# Altium schematic sheet [06] - FPGA Aux.SchDoc
size A3
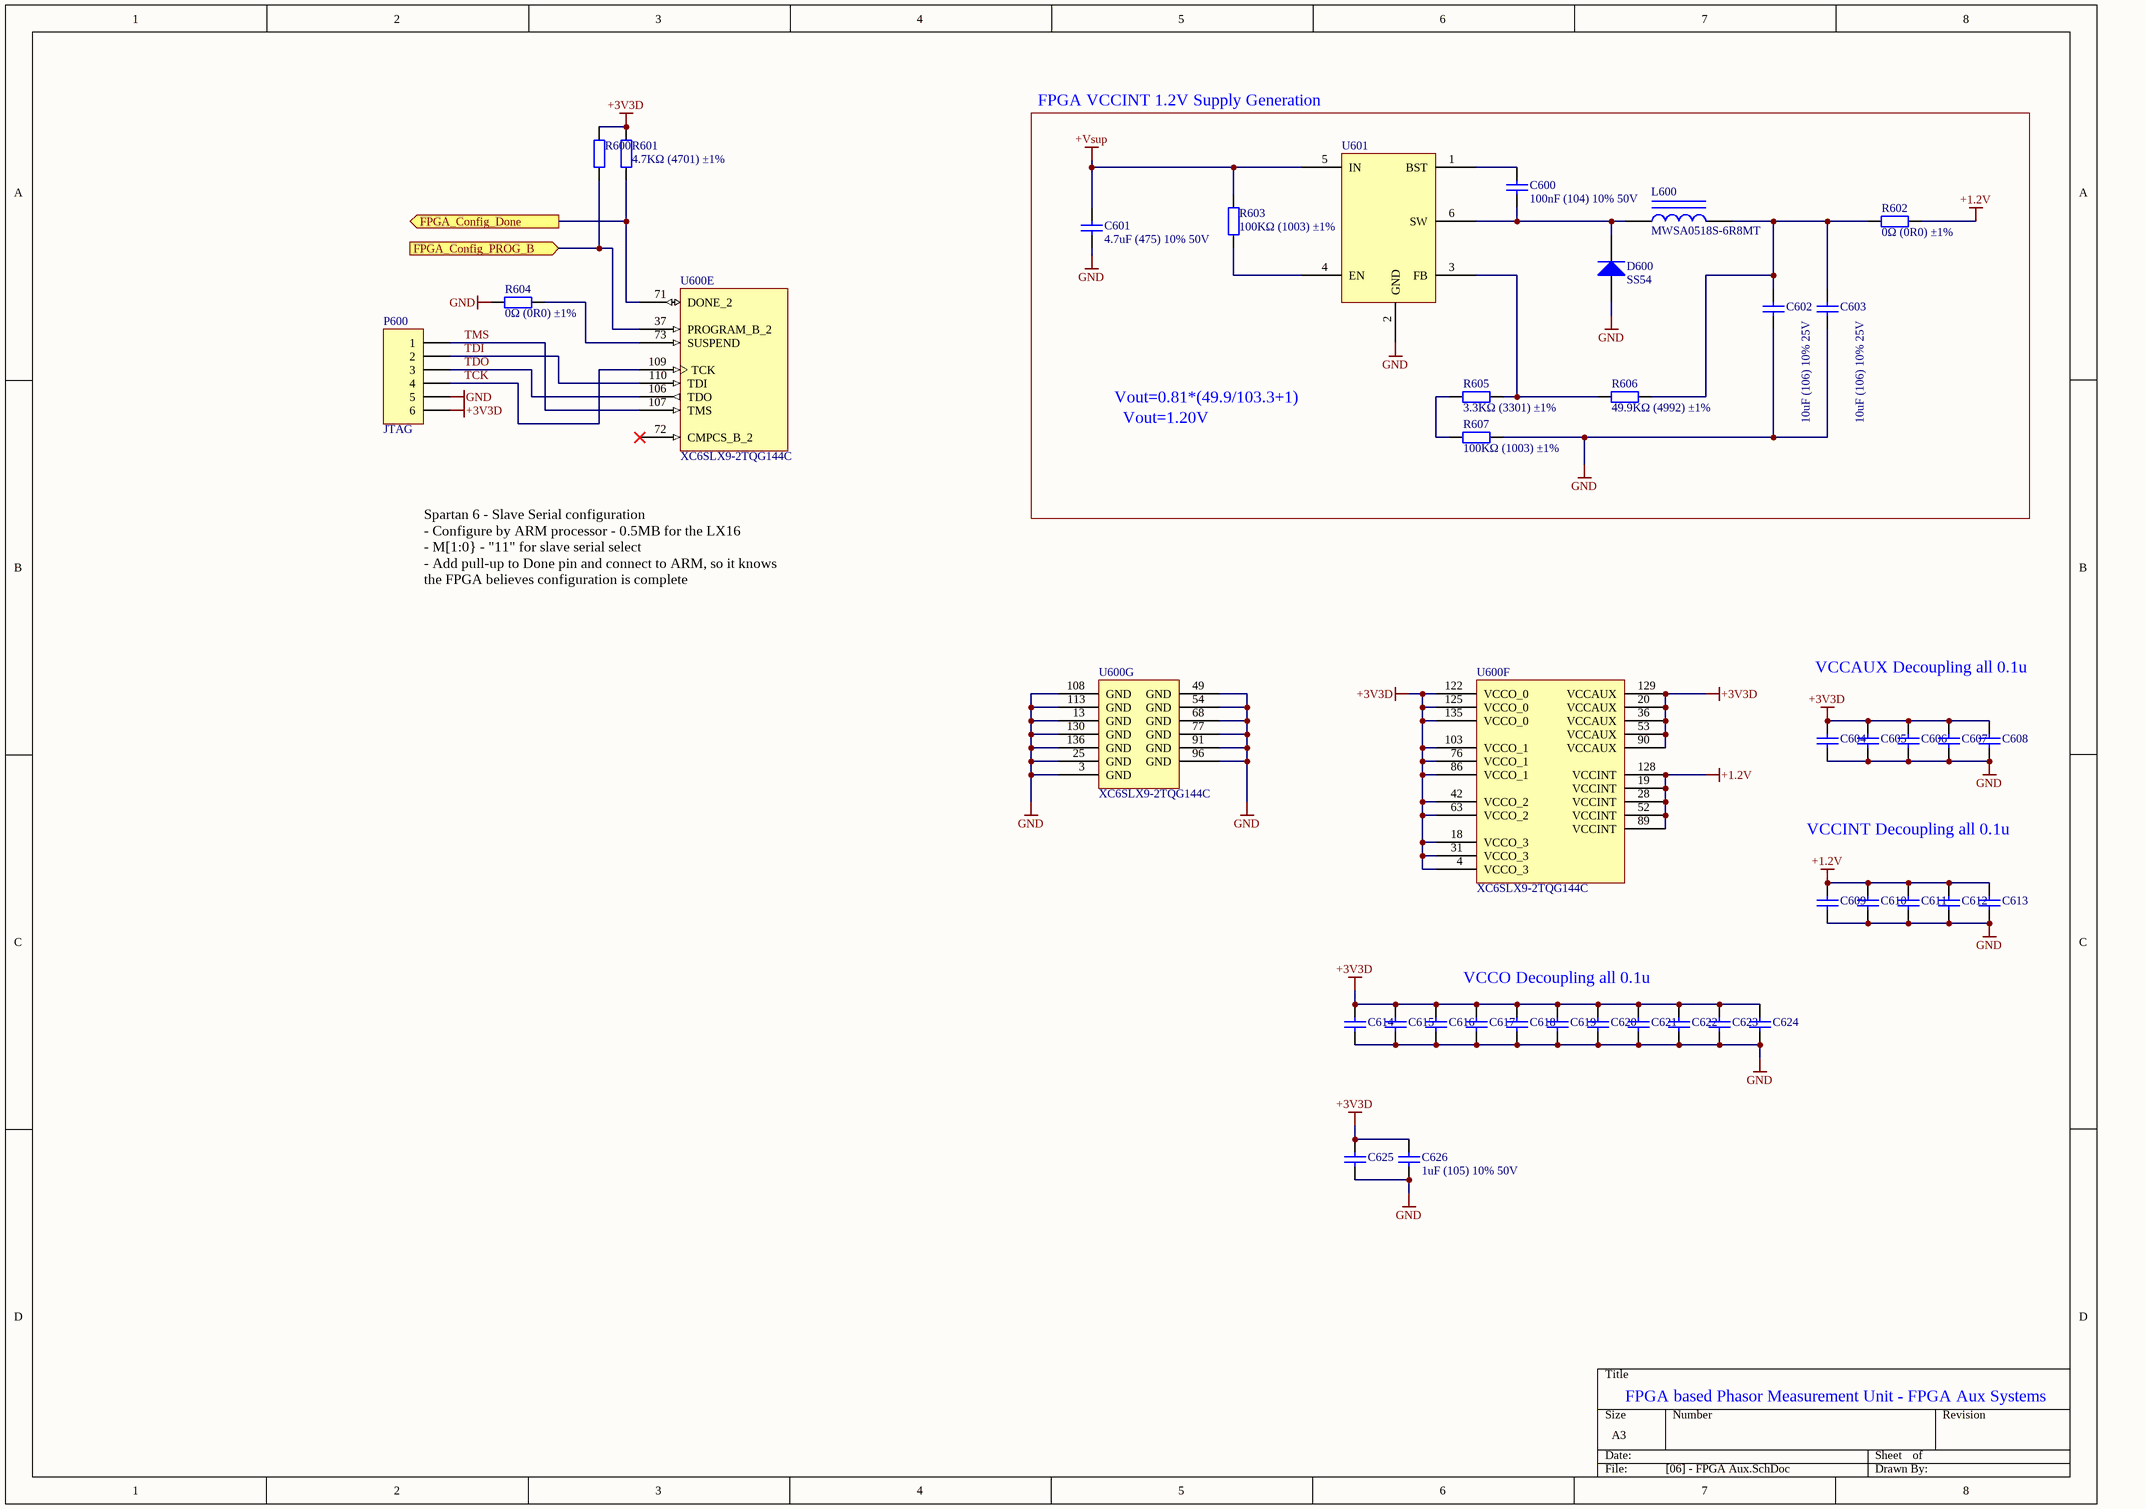
[diagram p0: [06] - FPGA Aux.SchDoc]

## Parts
C600  100nF (104) 10% 50V  [0603_C]
C601  4.7uF (475) 10% 50V  [1206_C]
C602  10uF (106) 10% 25V  [0805_C]
C603  10uF (106) 10% 25V  [0805_C]
C604  100nF (104) 10% 16V  [0402_C]  (value not drawn)
C605  100nF (104) 10% 16V  [0402_C]  (value not drawn)
C606  100nF (104) 10% 16V  [0402_C]  (value not drawn)
C607  100nF (104) 10% 16V  [0402_C]  (value not drawn)
C608  100nF (104) 10% 16V  [0402_C]  (value not drawn)
C609  100nF (104) 10% 16V  [0402_C]  (value not drawn)
C610  100nF (104) 10% 16V  [0402_C]  (value not drawn)
C611  100nF (104) 10% 16V  [0402_C]  (value not drawn)
C612  100nF (104) 10% 16V  [0402_C]  (value not drawn)
C613  100nF (104) 10% 16V  [0402_C]  (value not drawn)
C614  100nF (104) 10% 16V  [0402_C]  (value not drawn)
C615  100nF (104) 10% 16V  [0402_C]  (value not drawn)
C616  100nF (104) 10% 16V  [0402_C]  (value not drawn)
C617  100nF (104) 10% 16V  [0402_C]  (value not drawn)
C618  100nF (104) 10% 16V  [0402_C]  (value not drawn)
C619  100nF (104) 10% 16V  [0402_C]  (value not drawn)
C620  100nF (104) 10% 16V  [0402_C]  (value not drawn)
C621  100nF (104) 10% 16V  [0402_C]  (value not drawn)
C622  100nF (104) 10% 16V  [0402_C]  (value not drawn)
C623  100nF (104) 10% 16V  [0402_C]  (value not drawn)
C624  100nF (104) 10% 16V  [0402_C]  (value not drawn)
C625  1uF (105) 10% 50V  [0603_C]  (value not drawn)
C626  1uF (105) 10% 50V  [0603_C]
D600  SS54  [SMA(DO-214AC)_S1]
L600  MWSA0518S-6R8MT  [MWSA0518]
P600  JTAG  [HDR1X6]
R600  4.7KΩ (4701) ±1%  [0402_R]  (value not drawn)
R601  4.7KΩ (4701) ±1%  [0402_R]
R602  0Ω (0R0) ±1%  [0805_R]
R603  100KΩ (1003) ±1%  [0402_R]
R604  0Ω (0R0) ±1%  [0402_R]
R605  3.3KΩ (3301) ±1%  [0402_R]
R606  49.9KΩ (4992) ±1%  [0402_R]
R607  100KΩ (1003) ±1%  [0402_R]
U600  XC6SLX9-2TQG144C  [TQG144_N]  (parts E,F,G of 7)
U601  STEP-DOWN CONVERTER  [*TSOT-23_S6]  (value not drawn)

## Ports
FPGA_Config_Done (out), FPGA_Config_PROG_B (in)

## Nets
+1.2V: C609.2 C610.2 C611.2 C612.2 C613.2 R602.2 U600.19(VCCINT) U600.28(VCCINT) U600.52(VCCINT) U600.89(VCCINT) U600.128(VCCINT)
+3V3D: C604.2 C605.2 C606.2 C607.2 C608.2 C614.2 C615.2 C616.2 C617.2 C618.2 C619.2 C620.2 C621.2 C622.2 C623.2 C624.2 C625.2 C626.2 P600.6 R600.2 R601.2 U600.4(VCCO_3) U600.18(VCCO_3) U600.20(VCCAUX) U600.31(VCCO_3) U600.36(VCCAUX) U600.42(VCCO_2) U600.53(VCCAUX) U600.63(VCCO_2) U600.76(VCCO_1) U600.86(VCCO_1) U600.90(VCCAUX) U600.103(VCCO_1) U600.122(VCCO_0) U600.125(VCCO_0) U600.129(VCCAUX) U600.135(VCCO_0)
+Vsup: C601.2 R603.2 U601.5(IN)
GND: C601.1 C602.1 C603.1 C604.1 C605.1 C606.1 C607.1 C608.1 C609.1 C610.1 C611.1 C612.1 C613.1 C614.1 C615.1 C616.1 C617.1 C618.1 C619.1 C620.1 C621.1 C622.1 C623.1 C624.1 C625.1 C626.1 D600.1(A) P600.5 R604.1 R607.1 U600.3(GND) U600.13(GND) U600.25(GND) U600.49(GND) U600.54(GND) U600.68(GND) U600.77(GND) U600.91(GND) U600.96(GND) U600.108(GND) U600.113(GND) U600.130(GND) U600.136(GND) U601.2(GND)
FPGA_Config_Done: R601.1 U600.71(DONE_2) ; port FPGA_Config_Done
FPGA_Config_PROG_B: R600.1 U600.37(PROGRAM_B_2) ; port FPGA_Config_PROG_B
TCK: P600.4 U600.109(TCK)
TDI: P600.2 U600.110(TDI)
TDO: P600.3 U600.106(TDO)
TMS: P600.1 U600.107(TMS)
NetC600_1: C600.1 D600.2(K) L600.1 U601.6(SW)
NetC600_2: C600.2 U601.1(BST)
NetC602_2: C602.2 C603.2 L600.2 R602.1 R606.2
NetR603_1: R603.1 U601.4(EN)
NetR604_2: R604.2 U600.73(SUSPEND)
NetR605_1: R605.1 R606.1 U601.3(FB)
NetR605_2: R605.2 R607.2

Not connected (* = marked no-connect by the designer): U600 72(CMPCS_B_2)*

## Notes on the sheet
- FPGA VCCINT 1.2V Supply Generation
- Vout=1.20V
- Vout=0.81*(49.9/103.3+1)
- Spartan 6 - Slave Serial configuration
  - Configure by ARM processor - 0.5MB for the LX16
  - M[1:0} - "11" for slave serial select
  - Add pull-up to Done pin and connect to ARM, so it knows the FPGA believes configuration is complete
- VCCAUX Decoupling all 0.1u
- VCCINT Decoupling all 0.1u
- VCCO Decoupling all 0.1u
- FPGA based Phasor Measurement Unit - FPGA Aux Systems

## Library data of the parts
C600 = 0603 100nF (104) 10% 50V: 贴片电容; ComponentLink1Description: 供应商链接; ComponentLink1URL: http://www.szlcsc.com/product/details_15331.html; Package: 0603; Supplier: LC; SuppliersPartNumber: C14663
C601 = 1206 4.7uF (475) 10% 50V: 贴片电容; ComponentLink1Description: 供应商链接; ComponentLink1URL: http://www.szlcsc.com/product/details_30577.html; Package: 1206; Supplier: LC; SuppliersPartNumber: C29823
C602 C603 = 0805 10uF (106) 10% 25V: 贴片电容; ComponentLink1Description: 供应商链接; ComponentLink1URL: http://www.szlcsc.com/product/details_16532.html; Package: 0805; Supplier: LC; SuppliersPartNumber: C15850
C604-C624 = 0402 100nF (104) 10% 16V: 贴片电容; ComponentLink1Description: 供应商链接; ComponentLink1URL: http://www.szlcsc.com/product/details_1877.html; Package: 0402; Supplier: LC; SuppliersPartNumber: C1525
C625 C626 = 0603 1uF (105) 10% 50V: 贴片电容; ComponentLink1Description: 供应商链接; ComponentLink1URL: http://www.szlcsc.com/product/details_16531.html; Package: 0603; Supplier: LC; SuppliersPartNumber: C15849
D600 = SMA(DO-214AC) SS54: 二极管; ComponentLink1Description: 供应商链接; ComponentLink1URL: http://www.szlcsc.com/product/details_23178.html; Package: SMA(DO-214AC); Supplier: LC; SuppliersPartNumber: C22452
L600 = MWSA0518S-6R8MT: POWER INDUCTORS SMD,5.2X5.4X1.8MM ROHS; Value: 6.8uH; Current Rating: 5.0A; Package: 5.2X5.4X1.8MM; Supplier: LC; SuppliersPartNumber: C408348
P600 = Header 6: Header, 6-Pin; LatestRevisionDate: 17-Jul-2002; LatestRevisionNote: Re-released for DXP Platform.; Publisher: Altium Limited; JLCPCB: NO
R600 R601 = 0402 4.7KΩ (4701) 1%: 贴片电阻; ComponentLink1Description: 供应商链接; ComponentLink1URL: http://www.szlcsc.com/product/details_26643.html; Package: 0402; Supplier: LC; SuppliersPartNumber: C25900
R602 = 0805 0Ω (0R0) 1%: 贴片电阻; ComponentLink1Description: 供应商链接; ComponentLink1URL: http://www.szlcsc.com/product/details_18165.html; Package: 0805; Supplier: LC; SuppliersPartNumber: C17477
R603 R607 = 0402 100KΩ (1003) 1%: 贴片电阻; ComponentLink1Description: 供应商链接; ComponentLink1URL: http://www.szlcsc.com/product/details_26484.html; Package: 0402; Supplier: LC; SuppliersPartNumber: C25741
R604 = 0402 0Ω (0R0) 1%: 贴片电阻; ComponentLink1Description: 供应商链接; ComponentLink1URL: http://www.szlcsc.com/product/details_17853.html; Package: 0402; Supplier: LC; SuppliersPartNumber: C17168
R605 = 0402 3.3KΩ (3301) 1%: 贴片电阻; ComponentLink1Description: 供应商链接; ComponentLink1URL: http://www.szlcsc.com/product/details_26633.html; Package: 0402; Supplier: LC; SuppliersPartNumber: C25890
R606 = 0402 49.9KΩ (4992) 1%: 贴片电阻; ComponentLink1Description: 供应商链接; ComponentLink1URL: http://www.szlcsc.com/product/details_26640.html; Package: 0402; Supplier: LC; SuppliersPartNumber: C25897
U600 = CMP-0067-00454-1: Spartan-6 LX 1.2V FPGA, 102 User I/Os, 144-Pin TQFP (0.5mm Pitch), Speed Grade 2, Commercial Grade, Pb-Free; PackageVersion: ver1.2, Jun-2004; DatasheetVersion: ver1.6, Nov-2010; PackageDescription: 144-Pin Thin Quad Flat Pack (TQG144) - Pb-Free; PackageReference: TQG144; Code_JEDEC: MS-026-BFB; SuppliersPartNumber: C27408
U601 = MP2359: 1.2A, 24V, 1.4MHz STEP-DOWN CONVERTER IN A TSOT23-6; SuppliersPartNumber: C14259